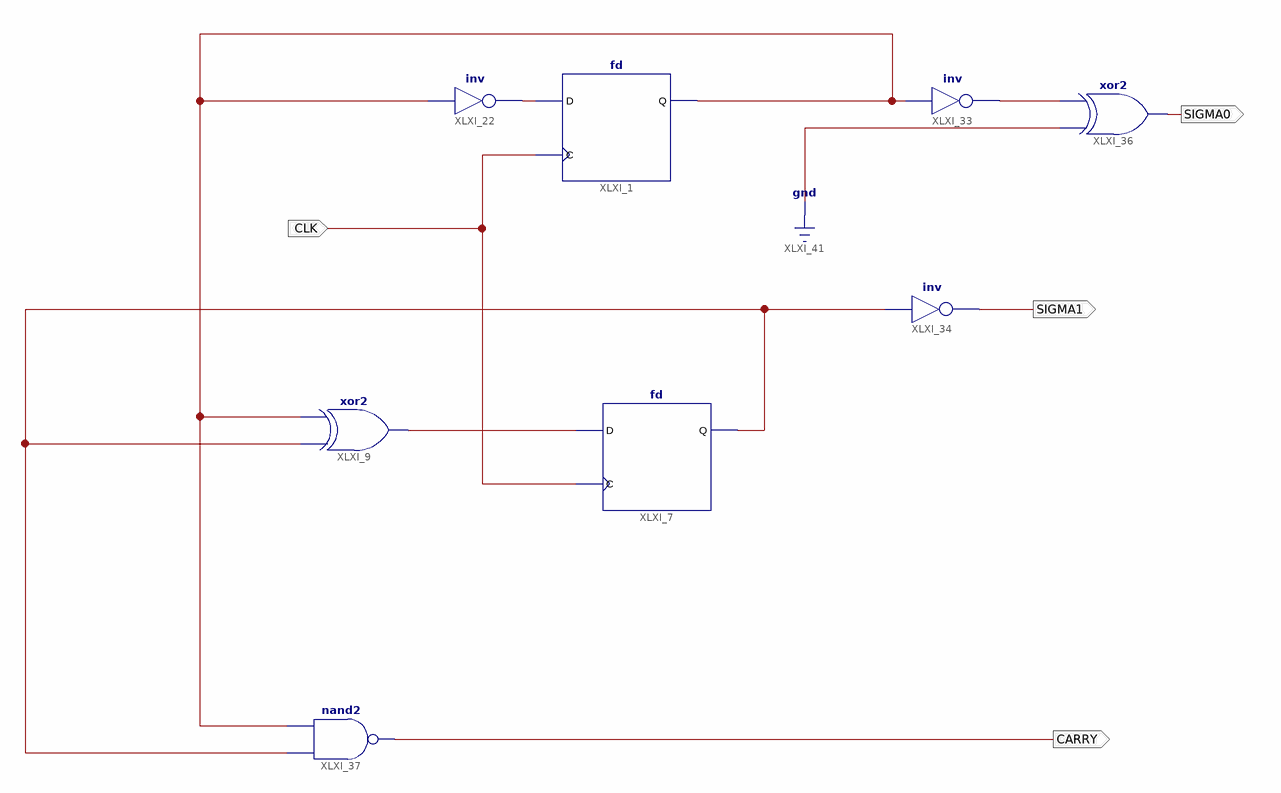
[diagram p0: schematic sheet 1]
// Xilinx ISE schematic CNT2.sch (spartan6) as structural Verilog: 8 symbols, 4 ports
module CNT2 (
  input  CLK,
  output SIGMA1,
  output CARRY,
  output SIGMA0
);

  wire SIGMA011, SIGMA111, XLXN_33, XLXN_73, XLXN_86;

  fd XLXI_7 (.C(CLK), .D(XLXN_33), .Q(SIGMA111));
  xor XLXI_9 (XLXN_33, SIGMA111, SIGMA011);
  fd XLXI_1 (.C(CLK), .D(XLXN_73), .Q(SIGMA011));
  not XLXI_22 (XLXN_73, SIGMA011);
  not XLXI_33 (XLXN_86, SIGMA011);
  not XLXI_34 (SIGMA1, SIGMA111);
  xor XLXI_36 (SIGMA0, 1'b0, XLXN_86);
  nand XLXI_37 (CARRY, SIGMA111, SIGMA011);
endmodule
